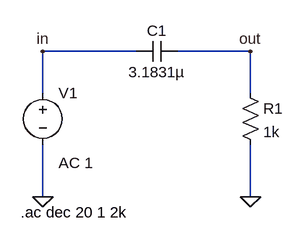
[diagram p0: schematic RC_highpass Filter.asc]
RC_highpass Filter.asc, the LTspice schematic file:
Version 4
SHEET 1 880 680
WIRE 240 48 96 48
WIRE 416 48 304 48
WIRE 96 112 96 48
WIRE 416 112 416 48
WIRE 96 272 96 192
WIRE 416 272 416 192
FLAG 96 272 0
FLAG 416 272 0
FLAG 416 48 out
FLAG 96 48 in
SYMBOL voltage 96 96 R0
WINDOW 123 24 124 Left 2
WINDOW 39 0 0 Left 0
SYMATTR InstName V1
SYMATTR Value ""
SYMATTR Value2 AC 1
SYMBOL cap 240 64 R270
WINDOW 0 32 32 VTop 2
WINDOW 3 0 32 VBottom 2
SYMATTR InstName C1
SYMATTR Value 3.1831µ
SYMBOL res 400 96 R0
SYMATTR InstName R1
SYMATTR Value 1k
TEXT 62 296 Left 2 !.ac dec 20 1 2k

The netlist it stands for:
* RC_highpass Filter.asc
V1 in 0 AC 1
C1 in out 3.1831µ
R1 out 0 1k
.ac dec 20 1 2k
.backanno
.end

* Results of the author's LTspice run, read from the files saved beside the schematic
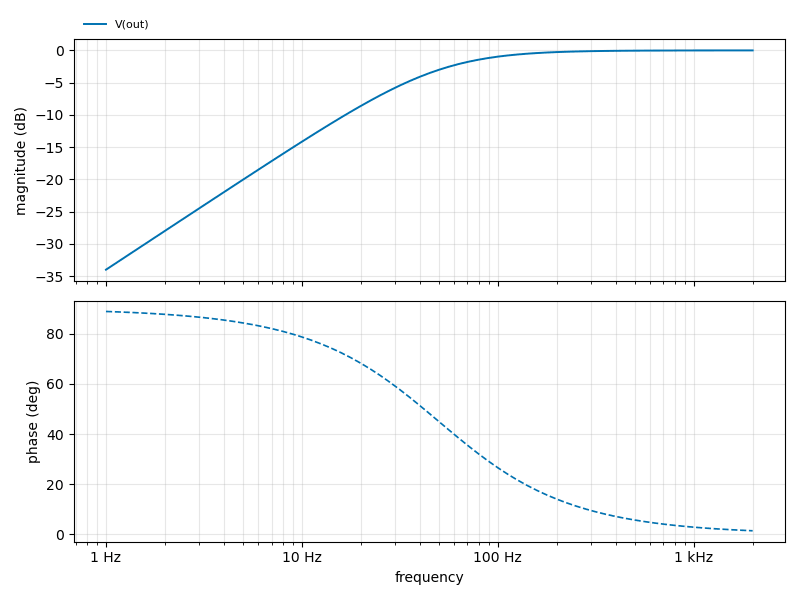
[diagram p1: AC Analysis of RC_highpass Filter.asc, plotted from the saved traces]
* AC Analysis, 1 run:
*   V(out): -33.98 dB at 1 Hz, -0.00 dB at 2 kHz, peak -0.00 dB at 2 kHz, 3 dB below the peak at 49.98 Hz